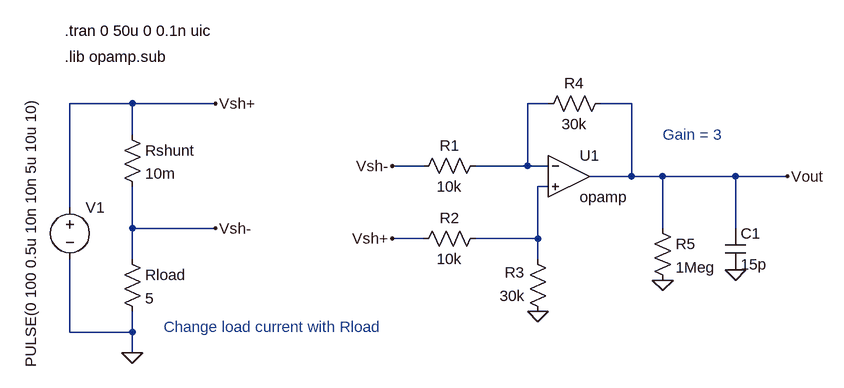
[diagram p0: schematic 10_1_opamp_curr.asc]
10_1_opamp_curr.asc, the LTspice schematic file:
Version 4
SHEET 1 1196 680
WIRE 48 -48 -48 -48
WIRE 176 -48 48 -48
WIRE 688 -48 656 -48
WIRE 816 -48 768 -48
WIRE 48 0 48 -48
WIRE 496 48 448 48
WIRE 656 48 656 -48
WIRE 656 48 576 48
WIRE 688 48 656 48
WIRE 816 64 816 -48
WIRE 816 64 752 64
WIRE 864 64 816 64
WIRE 976 64 864 64
WIRE 1056 64 976 64
WIRE 688 80 672 80
WIRE -48 112 -48 -48
WIRE 48 144 48 80
WIRE 176 144 48 144
WIRE 864 144 864 64
WIRE 976 144 976 64
WIRE 496 160 448 160
WIRE 672 160 672 80
WIRE 672 160 576 160
WIRE 48 192 48 144
WIRE 672 192 672 160
WIRE -48 304 -48 192
WIRE 48 304 48 272
WIRE 48 304 -48 304
WIRE 48 336 48 304
FLAG 48 336 0
FLAG 176 -48 Vsh+
FLAG 176 144 Vsh-
FLAG 448 160 Vsh+
FLAG 448 48 Vsh-
FLAG 672 272 0
FLAG 864 224 0
FLAG 976 208 0
FLAG 1056 64 Vout
SYMBOL voltage -48 96 R0
WINDOW 3 -60 -156 VRight 2
WINDOW 123 0 0 Left 0
WINDOW 39 0 0 Left 0
SYMATTR Value PULSE(0 100 0.5u 10n 10n 5u 10u 10)
SYMATTR InstName V1
SYMBOL res 32 -16 R0
SYMATTR InstName Rshunt
SYMATTR Value 10m
SYMBOL res 32 176 R0
SYMATTR InstName Rload
SYMATTR Value 5
SYMBOL OpAmps\\opamp 720 0 R0
SYMATTR InstName U1
SYMBOL res 592 32 R90
WINDOW 0 0 56 VBottom 2
WINDOW 3 32 56 VTop 2
SYMATTR InstName R1
SYMATTR Value 10k
SYMBOL res 592 144 R90
WINDOW 0 0 56 VBottom 2
WINDOW 3 32 56 VTop 2
SYMATTR InstName R2
SYMATTR Value 10k
SYMBOL res 688 288 R180
WINDOW 0 36 76 Left 2
WINDOW 3 36 40 Left 2
SYMATTR InstName R3
SYMATTR Value 30k
SYMBOL res 672 -32 R270
WINDOW 0 32 56 VTop 2
WINDOW 3 0 56 VBottom 2
SYMATTR InstName R4
SYMATTR Value 30k
SYMBOL res 848 128 R0
SYMATTR InstName R5
SYMATTR Value 1Meg
SYMBOL cap 960 144 R0
SYMATTR InstName C1
SYMATTR Value 15p
TEXT -56 -120 Left 2 !.lib opamp.sub
TEXT -56 -160 Left 2 !.tran 0 50u 0 0.1n uic
TEXT 864 0 Left 2 ;Gain = 3
TEXT 96 296 Left 2 ;Change load current with Rload

The netlist it stands for:
* 10_1_opamp_curr.asc
V1 Vsh+ 0 PULSE(0 100 0.5u 10n 10n 5u 10u 10)
Rshunt Vsh+ Vsh- 10m
Rload Vsh- 0 5
XU1 N001 N002 Vout opamp Aol=100K GBW=10Meg  ; pins invin noninvin out
R1 N001 Vsh- 10k
R2 N002 Vsh+ 10k
R3 0 N002 30k
R4 N001 Vout 30k
R5 Vout 0 1Meg
C1 Vout 0 15p
.lib opamp.sub
.tran 0 50u 0 0.1n uic
* Gain = 3
* Change load current with Rload
.backanno
.end